# EAGLE design IRHat2 (EAGLE 9.5.2)
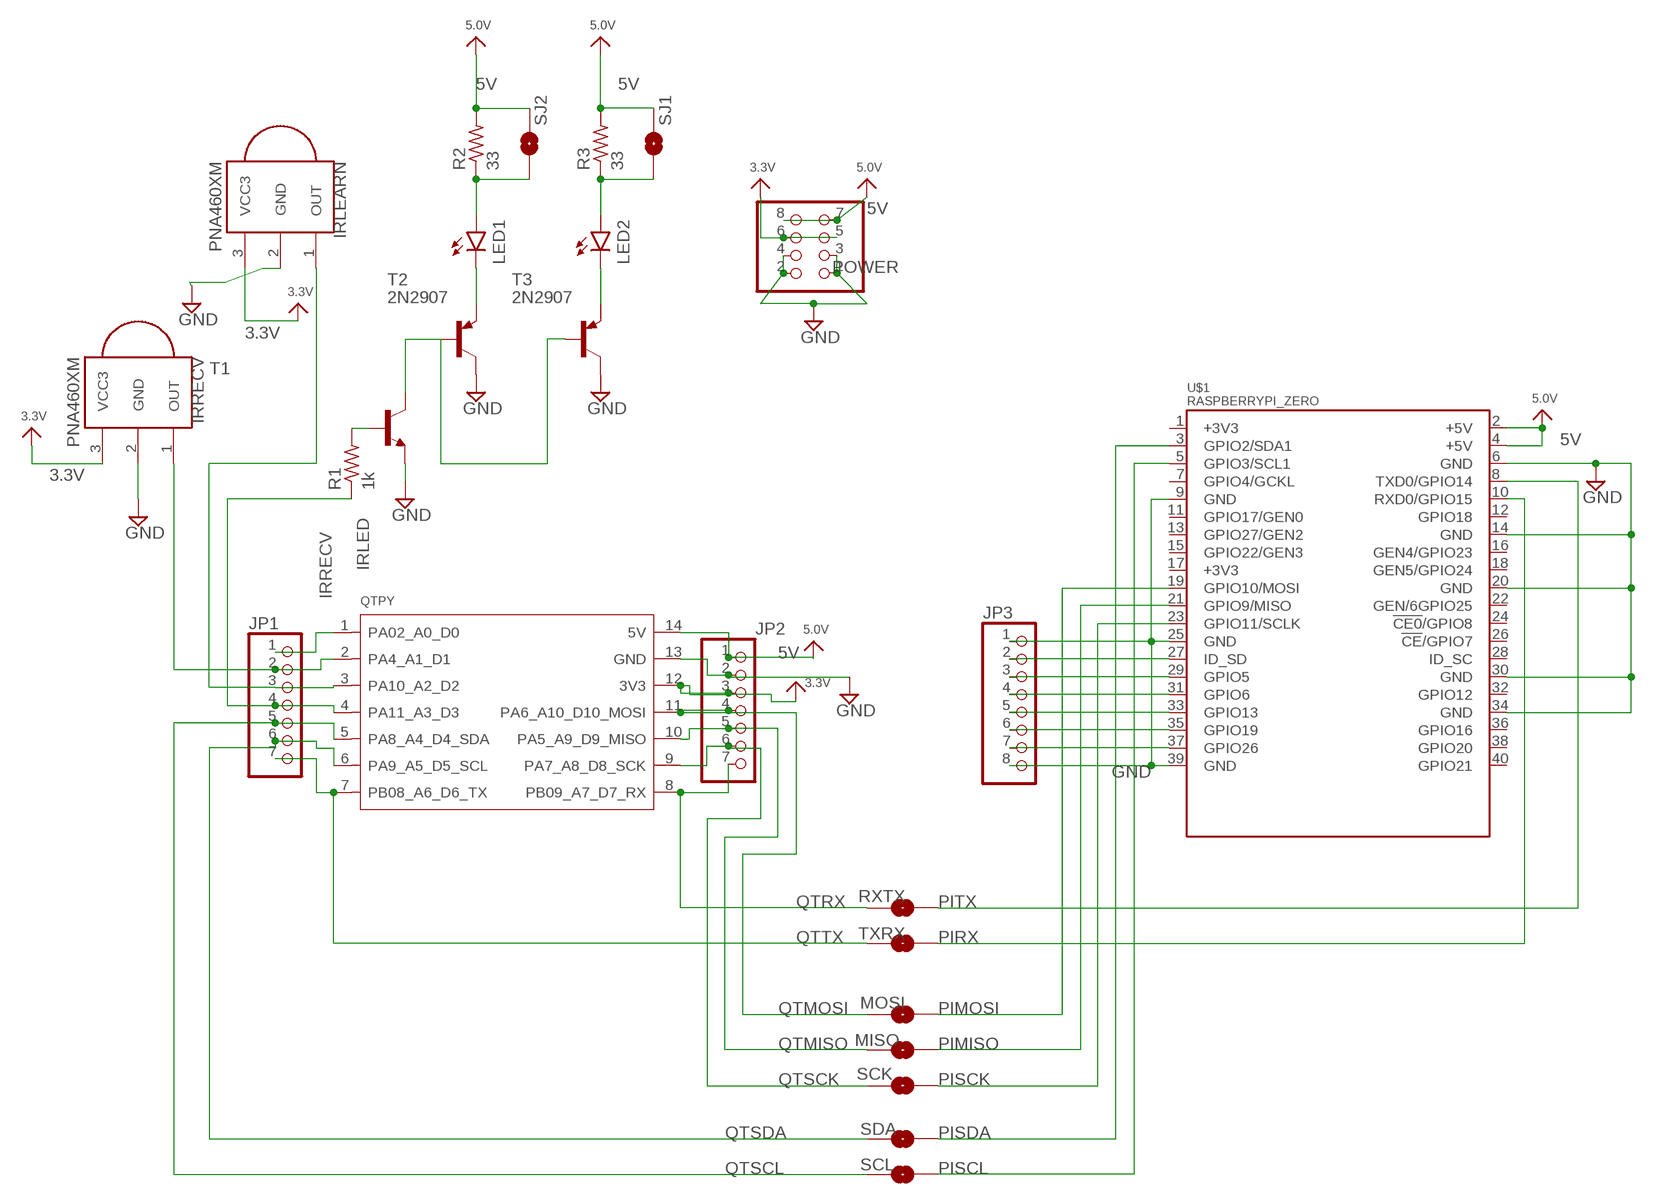
[diagram p0: schematic, sheet 1]

## Parts
IRLEARN  PNA460XM  [PNA460XM]
IRRECV  PNA460XM  [PNA460XM]
JP1  PINHD-1X7  [1X07]
JP2  PINHD-1X7  [1X07]
JP3  PINHD-1X8CLEANBIG  [1X08-CLEANBIG]
LED1  LED-IRTSAL6100  [LED_5MM]
LED2  LED-IRTSAL6100  [LED_5MM]
MISO  SPARKFUN_SOLDERJUMPERNO  [SPARKFUN_SJ_2S-NO]
MOSI  SPARKFUN_SOLDERJUMPERNO  [SPARKFUN_SJ_2S-NO]
POWER  PINHD-2X4  [2X04]
QTPY  MOUDLE-SEEEDUINO-XIAO  [MOUDLE14P-2.54-21X17.8MM]
R1  1k  R-US_0204/5  [0204/5]
R2  33  R-US_0204/5  [0204/5]
R3  33  R-US_0204/5  [0204/5]
RXTX  SPARKFUN_SOLDERJUMPERTRACE  [SPARKFUN_SJ_2S-TRACE]
SCK  SPARKFUN_SOLDERJUMPERNO  [SPARKFUN_SJ_2S-NO]
SCL  SPARKFUN_SOLDERJUMPERNO  [SPARKFUN_SJ_2S-NO]
SDA  SPARKFUN_SOLDERJUMPERNO  [SPARKFUN_SJ_2S-NO]
SJ1  SPARKFUN_SOLDERJUMPERTRACE  [SPARKFUN_SJ_2S-TRACE]
SJ2  SPARKFUN_SOLDERJUMPERTRACE  [SPARKFUN_SJ_2S-TRACE]
T1  -NPN-TO92-EBC  [TO92-EBC]
T2  2N2907  MPSA56-TO92  [TO92-CBE]
T3  2N2907  MPSA56-TO92  [TO92-CBE]
TXRX  SPARKFUN_SOLDERJUMPERTRACE  [SPARKFUN_SJ_2S-TRACE]
U$1  RASPBERRYPI_ZERO  [RASPBERRYPI_ZERO]

## Nets
3.3V: IRLEARN.3(VCC3) IRRECV.3(VCC3) JP2.3 POWER.5 POWER.6 QTPY.12(3V3)
5V: JP2.1 POWER.7 POWER.8 QTPY.14(5V) R2.2 R3.2 SJ1.2 SJ2.2 U$1.2(+5V) U$1.4(+5V) ; supply symbol labelled 5.0V
GND: IRLEARN.2(GND) IRRECV.2(GND) JP2.2 JP3.1 JP3.8 POWER.1 POWER.2 POWER.3 POWER.4 QTPY.13(GND) T1.E T2.C T3.C U$1.6(GND) U$1.9(GND) U$1.14(GND) U$1.20(GND) U$1.25(GND) U$1.30(GND) U$1.34(GND) U$1.39(GND)
IRLED: JP1.4 QTPY.4(PA11_A3_D3) R1.1
IRRECV: IRRECV.1(OUT) JP1.2 QTPY.2(PA4_A1_D1)
N$1: JP3.2 U$1.27(ID_SD)
N$2: JP3.3 U$1.29(GPIO5)
N$3: LED1.K(C) T2.E
N$4: R1.2 T1.B
N$5: LED2.K(C) T3.E
N$6: JP3.4 U$1.31(GPIO6)
N$7: LED2.A R3.1 SJ1.1
N$8: T1.C T2.B T3.B
N$9: JP1.1 QTPY.1(PA02_A0_D0)
N$10: LED1.A R2.1 SJ2.1
N$11: JP3.5 U$1.33(GPIO13)
N$12: IRLEARN.1(OUT) JP1.3 QTPY.3(PA10_A2_D2)
N$13: JP3.6 U$1.35(GPIO19)
N$14: JP3.7 U$1.37(GPIO26)
PIMISO: MISO.2 U$1.21(GPIO9/MISO)
PIMOSI: MOSI.2 U$1.19(GPIO10/MOSI)
PIRX: TXRX.2 U$1.10(RXD0/GPIO15)
PISCK: SCK.2 U$1.23(GPIO11/SCLK)
PISCL: SCL.2 U$1.5(GPIO3/SCL1)
PISDA: SDA.2 U$1.3(GPIO2/SDA1)
PITX: RXTX.2 U$1.8(TXD0/GPIO14)
QTMISO: JP2.5 MISO.1 QTPY.10(PA5_A9_D9_MISO)
QTMOSI: JP2.4 MOSI.1 QTPY.11(PA6_A10_D10_MOSI)
QTRX: JP2.7 QTPY.8(PB09_A7_D7_RX) RXTX.1
QTSCK: JP2.6 QTPY.9(PA7_A8_D8_SCK) SCK.1
QTSCL: JP1.5 QTPY.5(PA8_A4_D4_SDA) SCL.1
QTSDA: JP1.6 QTPY.6(PA9_A5_D5_SCL) SDA.1
QTTX: JP1.7 QTPY.7(PB08_A6_D6_TX) TXRX.1
Unconnected: U$1.1(+3V3) U$1.7(GPIO4/GCKL) U$1.11(GPIO17/GEN0) U$1.12(GPIO18) U$1.13(GPIO27/GEN2) U$1.15(GPIO22/GEN3) U$1.16(GEN4/GPIO23) U$1.17(+3V3) U$1.18(GEN5/GPIO24) U$1.22(GEN/6GPIO25) U$1.24(!CE0!/GPIO8) U$1.26(!CE!/GPIO7) U$1.28(ID_SC) U$1.32(GPIO12) U$1.36(GPIO16) U$1.38(GPIO20) U$1.40(GPIO21)

## Library data of the parts
IRLEARN IRRECV = adafruit:PNA460XM: IR 38KHz receiver PNA4602 and related receivers http://www.ladyada.net/library/pcb/eaglelibrary.html
JP1 JP2 = pinhead:PINHD-1X7: PIN HEADER
JP3 = adafruit:PINHD-1X8: PIN HEADER
LED1 LED2 = SparkFun-LED:LED-IR: Infrared LED (IR) Wavelength: 940nm Packages: TSAL6100 LTE302 - Side firing. Check SparkFun-Sensors.lbr for the receiver SparkFun Products: ZX Distance and Gesture Sensor <[https://www.sparkfun.com/products/12780]> Infrared Emitters and Detectors <https://www.sparkfun.com/products/241>; PROD_ID: DIO-12058
MISO MOSI RXTX SCK SCL SDA SJ1 SJ2 TXRX = DECADE:SPARKFUN_SOLDERJUMPER: Solder Jumper Standard SMD solder jumper. Used to automate production. Two varients : Normally Open and Normally Closed are the same, but have different paste layers. NC will have a large amount of paste and should jumper during reflow.
POWER = adafruit:PINHD-2X4: PIN HEADER
QTPY = Seeeduino XIAO:MOUDLE-SEEEDUINO-XIAO
R1 = resistor:R-US_: RESISTOR, American symbol
R2 R3 = adafruit:R-US_: RESISTOR, American symbol
T1 = transistor:*-NPN-: NPN Transistror BF959 corrected 2008.03.06
T2 T3 = transistor-pnp:*-?: PNP Transistor
U$1 = milador:RASPBERRYPI_ZERO

## Board
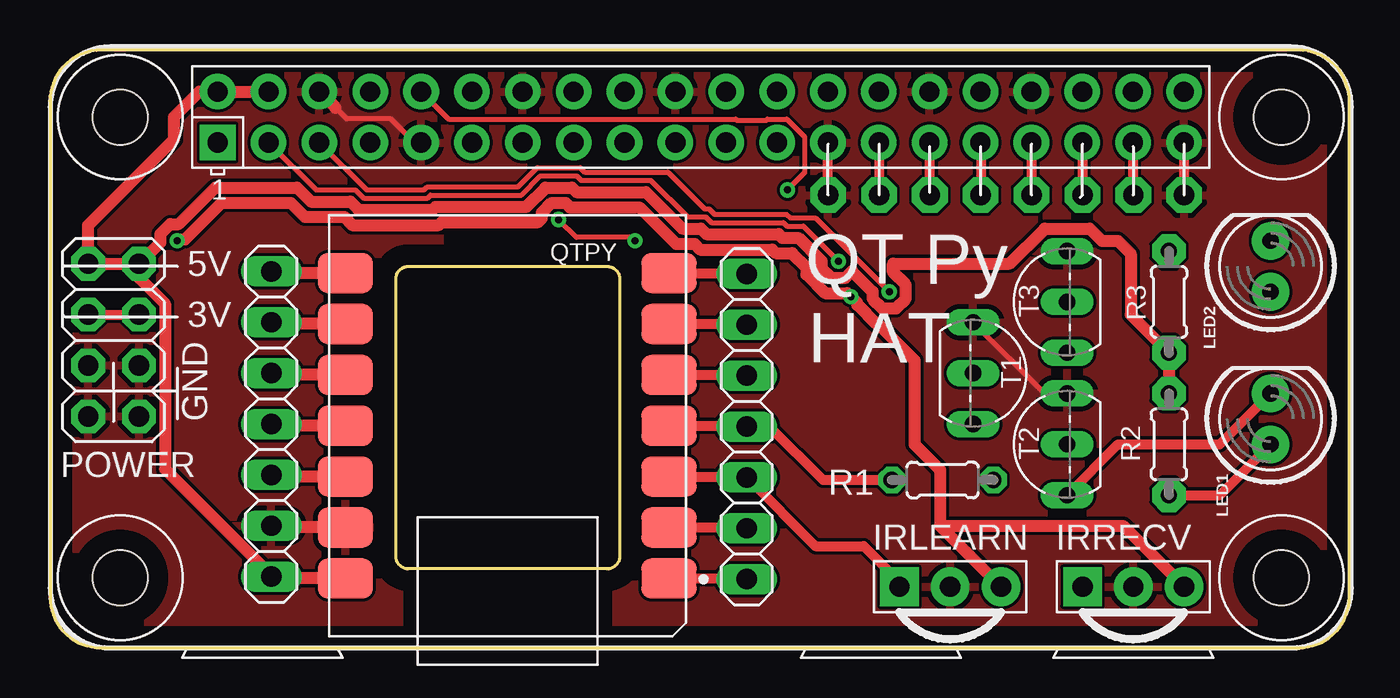
[diagram p1: board, top side]
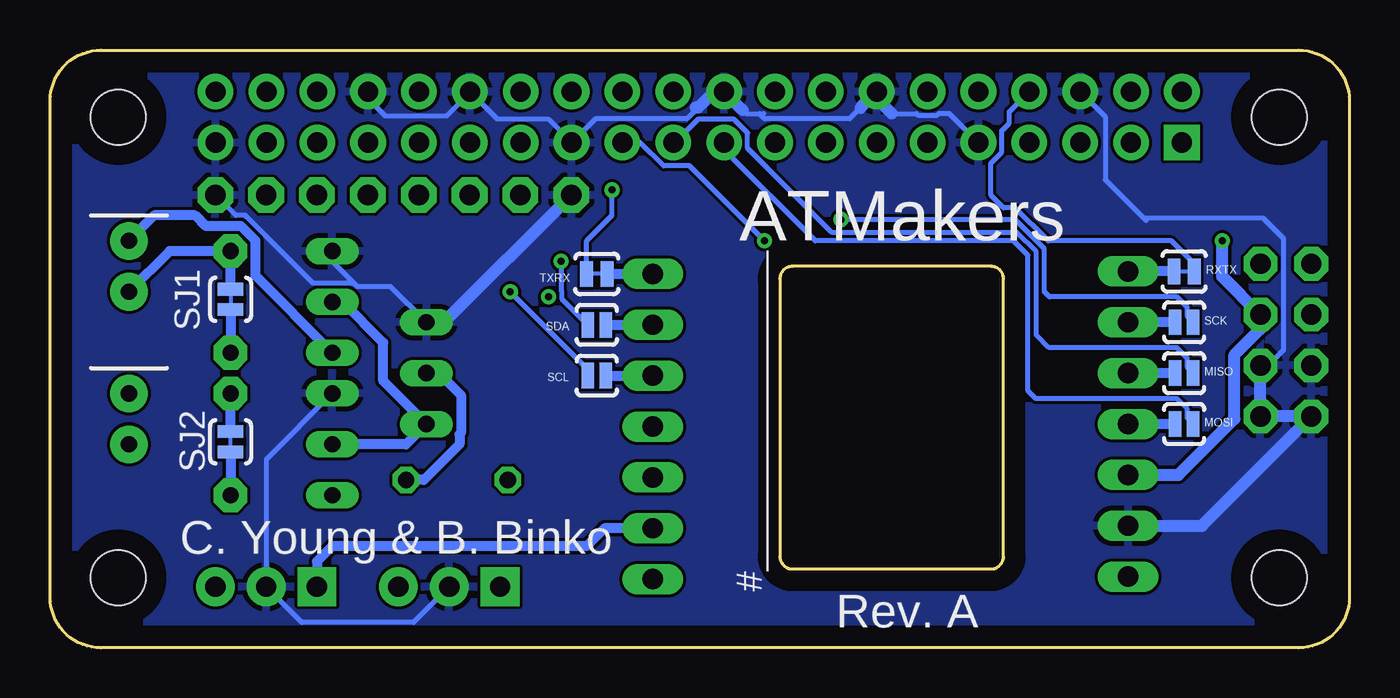
[diagram p2: board, bottom side, seen from below]

Size 64.9 x 29.84 mm. Coordinates in mm from the lower left corner, seen from the top.
Outline: 0,27.3 0,2.54 arc90 2.54,0 62.36,0 arc90 64.9,2.54 64.9,27.3 arc90 62.36,29.84 2.54,29.84 arc90 0,27.3
Outline: 27.81,3.94 17.91,3.94 arc-90 17.27,4.57 17.27,18.41 arc-90 17.91,19.05 27.81,19.05 arc-90 28.45,18.41 28.45,4.57 arc-90 27.81,3.94
Copper layers (1*16): Top 0.035mm / dielectric 1.5mm / Bottom 0.035mm
Design rules "default *": minimum track width 6mil, minimum drill 0.35mm, track to track 6mil, track to pad 6mil, pad to pad 6mil, via to via 6mil, smd to smd 6mil, copper to edge 40mil, drill to drill 6mil, minimum pad ring 10mil, minimum via ring 8mil, stop-mask expansion 4mil, vias tented up to drill 25mil, thermal gap 10mil

### Footprints (pad centres in the part's own frame; a part is rotated, then mirrored left to right if it is on the bottom)
PNA460XM = drill 1.016 pad 1.93 square: 1 -2.54,0 | drill 1.016 pad 1.93: 2 0,0; 3 2.54,0
1X07 = drill 1.016 long: 1 -7.62,0; 2 -5.08,0; 3 -2.54,0; 4 0,0; 5 2.54,0; 6 5.08,0; 7 7.62,0
1X08-CLEANBIG = drill 1.016 pad 1.778 octagon: 1 -8.89,0; 2 -6.35,0; 3 -3.81,0; 4 -1.27,0; 5 1.27,0; 6 3.81,0; 7 6.35,0; 8 8.89,0
LED_5MM = drill 0.813 pad 1.88: A -1.27,0; K 1.27,0
SPARKFUN_SJ_2S-NO = smd 0.635 x 1.27: 1 -0.45,0; 2 0.45,0
2X04 = drill 1.016 pad 1.676 octagon: 1 -3.81,-1.27; 2 -3.81,1.27; 3 -1.27,-1.27; 4 -1.27,1.27; 5 1.27,-1.27; 6 1.27,1.27; 7 3.81,-1.27; 8 3.81,1.27
MOUDLE14P-2.54-21X17.8MM = smd 2.75 x 2: 1 0.835,18.12; 2 0.835,15.58; 3 0.835,13.04; 4 0.835,10.5; 5 0.835,7.96; 6 0.835,5.42; 7 0.835,2.88; 8 17,2.88; 9 17,5.42; 10 17,7.96; 11 17,10.5; 12 17,13.04; 13 17,15.58; 14 17,18.12
0204/5 = drill 0.813 octagon: 1 -2.54,0; 2 2.54,0
0204/5' = drill 0.813 pad 1.676 octagon: 1 -2.54,0; 2 2.54,0
SPARKFUN_SJ_2S-TRACE = smd 0.635 x 1.27: 1 -0.508,0; 2 0.508,0
TO92-EBC = drill 0.813 long: B 0,-1.27; C 2.54,-1.27; E -2.54,-1.27
TO92-CBE = drill 0.813 long: B 0,0; C 2.54,0; E -2.54,0
RASPBERRYPI_ZERO = drill 1 pad 1.778 square: 1 8.37,25.23 | drill 1 pad 1.778: 2 8.37,27.77; 3 10.91,25.23; 4 10.91,27.77; 5 13.45,25.23; 6 13.45,27.77; 7 15.99,25.23; 8 15.99,27.77; 9 18.53,25.23; 10 18.53,27.77; 11 21.07,25.23; 12 21.07,27.77; 13 23.61,25.23; 14 23.61,27.77; 15 26.15,25.23; 16 26.15,27.77; 17 28.69,25.23; 18 28.69,27.77; 19 31.23,25.23; 20 31.23,27.77; 21 33.77,25.23; 22 33.77,27.77; 23 36.31,25.23; 24 36.31,27.77; 25 38.85,25.23; 26 38.85,27.77; 27 41.39,25.23; 28 41.39,27.77; 29 43.93,25.23; 30 43.93,27.77; 31 46.47,25.23; 32 46.47,27.77; 33 49.01,25.23; 34 49.01,27.77; 35 51.55,25.23; 36 51.55,27.77; 37 54.09,25.23; 38 54.09,27.77; 39 56.63,25.23; 40 56.63,27.77 | hole 2.75: 3.5,3.5; 3.5,26.5; 61.5,3.5; 61.5,26.5

### Placement (x,y rotation side)
IRLEARN  44.96,3.05 0 top
IRRECV  54.1,3.05 0 top
JP1  34.8,11.05 90 top
JP2  11.05,11.18 90 top
JP3  47.75,22.61 0 top
LED1  60.96,11.43 90 top
LED2  60.96,19.05 90 top
MISO  8.26,13.72 0 bottom
MOSI  8.26,11.18 0 bottom
POWER  3.17,15.37 90 top
QTPY  31.75,21.59 180 top
R1  44.58,8.38 0 top
R2  33  [0204/5']  55.88,10.16 90 top
R3  33  [0204/5']  55.88,17.27 270 top
RXTX  8.26,18.8 0 bottom
SCK  8.26,16.26 0 bottom
SCL  37.59,13.59 180 bottom
SDA  37.59,16.13 180 bottom
SJ1  55.88,17.4 270 bottom
SJ2  55.88,10.29 90 bottom
T1  47.37,13.72 270 top
T2  50.8,10.16 90 top
T3  50.8,17.27 90 top
TXRX  37.59,18.67 180 bottom
U$1  0,0 0 top

### Tracks (layer width: path | path; a pad name or v marks a point on that pad's centre or on a via)
3.3V  (via drill 0.35)
  Top 0.508: POWER.6 POWER.5
  Top 0.61: QTPY.12 11.13,8.55 JP2.3 | IRLEARN.3 44.45,6.1 | 44.45,6.1 44.45,8.89 43.18,10.16 43.18,14.35 41.35,16.18 41.25,16.18 40.31,17.12 40.31,17.22 v40.01,17.53 39.82,17.71 38.71,17.71 37.77,18.64 37.77,19 37.06,19.71 36.24,19.71 36.06,19.89 32.47,19.89 32.19,20.17 31.27,20.17 29.44,22 25.97,22 25.75,22.22 25.05,22.22 24.57,21.73 24.57,21.45 24.37,21.26 19.56,21.26 19.41,21.11 15.09,21.11 14.69,21.51 12.72,21.51 12.02,22.22 8.56,22.22 6.74,20.39 6.42,20.39 v6.35,20.32 | 44.45,6.1 53.59,6.1 IRRECV.3
  Bottom 0.61: JP2.3 8.53,8.64 5.74,11.43 5.74,14.63 4.45,15.93 POWER.5 6.35,18.54 v6.35,20.32
5V
  Top 0.61: QTPY.14 11.13,3.47 | 11.13,3.47 JP2.1 | POWER.7 POWER.8 1.91,21.09 6.2,25.38 6.2,26.52 7.45,27.77 U$1.2 U$1.4 | POWER.7 4.45,18.47 5.74,17.17 5.74,8.92 11.13,3.52 11.13,3.47 | POWER.7 5.51,20.25 5.51,20.67 6,21.16 6.42,21.16 8.25,22.98 12.33,22.98 13.04,22.28 15,22.28 15.41,21.87 19.09,21.87 19.24,22.02 23.78,22.02 24.74,22.98 26.06,22.98 26.29,22.76 29.75,22.76 31.59,20.93 32.5,20.93 32.78,20.65 36.38,20.65 36.56,20.47 37.38,20.47 38.53,19.31 38.53,18.96 39.02,18.47 39.72,18.47 40.06,18.81 41.08,17.79 41.08,17.43 41.56,16.95 42.26,16.95 42.74,17.43 42.74,18.13 42.11,18.76 42.11,19.18 47.92,19.18 49.68,20.93 51.92,20.93 52.53,20.32 53.34,20.32 53.98,19.68 53.98,16.64 R3.2 R2.2
  Bottom 0.508: SJ2.2 R2.2 | SJ1.2 R3.2
GND
  Top 0.254: U$1.9 18.2,25.23 17.02,26.42 14.8,26.42 14.26,26.96 | T1.E 49.66,12.7 T2.C
  Top 0.508: JP3.1 38.86,25.22 U$1.25 | U$1.39 JP3.8
  Top 0.61: QTPY.13 11.13,6.01 JP2.2 | 14.26,26.96 U$1.6
  Bottom 0.254: 30.3,26.84 30.13,26.67 29.46,26.67 | 29.46,26.67 29.24,26.67 | U$1.34 49.01,27.42 48.13,26.54 45.09,26.54 43.93,27.7 U$1.30 42.58,26.42 40.04,26.42 U$1.25 37.66,26.42 33.09,26.42 32.7,26.8 | 22.86,26.67 21.62,26.67 21.55,26.6 20.59,26.6 20.52,26.67 19.97,26.67 U$1.9 | U$1.6 12.19,26.51 12.19,23.37 10.29,21.46 | 10.29,21.46 10.16,21.34 | 10.29,21.46 4.32,21.46 3.3,20.45 3.3,14.86 4.06,14.1 POWER.3 | 24.42,26.96 24.96,26.42 29.21,26.42 29.46,26.67 | T1.E 47.88,18.03 49.53,18.03 | JP3.8 55.63,21.59 55.14,21.59 51.77,18.21 49.75,18.21 49.57,18.03 49.53,18.03 | T3.C 50.8,19.3 49.53,18.03 | T2.C 54.1,9.4 IRRECV.2 52.32,1.27 46.74,1.27 IRLEARN.2
  Bottom 0.61: POWER.3 POWER.1 POWER.2 7.37,6.1 JP2.2 | JP3.1 45.21,16.26 T1.E | 30.3,26.84 U$1.20 31.73,27.77 32.52,26.98 32.65,26.98 | 22.86,26.67 23.61,27.42 U$1.14 24.42,26.96
  pour Bottom: 0,30.48 64.77,30.48 64.77,0 0,0
  pour Top: 0,30.48 64.77,30.48 64.77,0 0,0
IRLED
  Top 0.508: QTPY.4 34.76,11.09 JP1.4 35.94,11.05 38.61,8.38 R1.1
IRRECV
  Top 0.508: QTPY.2 34.76,6.01 JP1.2
  Bottom 0.508: JP1.2 37.21,5.97 38.1,5.08 50.8,5.08 51.56,4.32 IRRECV.1
N$1
  Top 0.508: U$1.27 JP3.2
N$2
  Top 0.508: JP3.3 43.94,25.22 U$1.29
N$3
  Top 0.508: T2.E 53.34,10.16 58.42,10.16 LED1.K
N$4
  Bottom 0.508: T1.B 45.47,13.72 44.37,12.62 44.37,10.73 44.45,10.66 44.45,10.16 46.23,8.38 R1.2
N$5
  Bottom 0.508: T3.E 54.63,18.57 54.63,20.33 55.36,21.06 57.12,21.06 57.66,21.59 59.69,21.59 LED2.K
N$6
  Top 0.508: U$1.31 46.48,25.22 JP3.4
N$7
  Bottom 0.508: SJ1.1 R3.1 58.93,19.81 LED2.A
N$8
  Bottom 0.508: T2.B 47.12,10.16 T1.C 48.26,13.34 48.26,15.24 50.29,17.27 T3.B
N$9
  Top 0.508: QTPY.1 34.76,3.47 JP1.1
N$10
  Top 0.508: R2.1 58.42,7.62 LED1.A
  Bottom 0.508: SJ2.1 R2.1
N$11
  Top 0.508: U$1.33 49.02,25.22 JP3.5
N$12
  Top 0.508: QTPY.3 34.76,8.55 JP1.3 38.23,5.08 40.64,5.08 42.42,3.3 IRLEARN.1
N$13
  Top 0.508: U$1.35 JP3.6
N$14
  Top 0.508: U$1.37 JP3.7
PIMISO
  Bottom 0.254: MISO.2 8.11,14.02 8.11,14.47 8.63,14.99 15.01,14.99 15.65,15.62 15.65,19.77 16.61,20.73 25.84,20.73 30.06,24.95 30.06,25.71 30.75,26.4 32.53,26.4 33.7,25.23 U$1.21
PIMOSI
  Bottom 0.254: MOSI.2 8.11,11.48 8.11,11.93 8.63,12.45 15.67,12.45 16.05,12.83 16.05,19.6 16.77,20.32 26.67,20.32 31.23,24.88 U$1.19
PIRX  (via drill 0.35)
  Top 0.254: U$1.10 19.9,26.4 34.25,26.4 34.31,26.34 35.77,26.34 35.83,26.4 36.79,26.4 37.68,25.51 37.68,23.71 v36.83,22.86
  Bottom 0.254: v36.83,22.86 36.83,21.59 38.1,20.32 TXRX.2
PISCK  (via drill 0.35)
  Top 0.254: v29.21,20.32 29.04,20.5 26.29,20.5 v25.4,21.38
  Bottom 0.254: SCK.2 8.11,16.56 8.11,17.01 8.63,17.53 14.99,17.53 15.24,17.78 15.24,19.94 16.69,21.38 v25.4,21.38 | v29.21,20.32 32.95,24.06 34.25,24.06 35.42,25.23 U$1.23
PISCL  (via drill 0.35)
  Top 0.254: U$1.5 15.82,22.86 18.68,22.86 18.83,23.01 23.37,23.01 24.33,23.97 26.47,23.97 26.7,23.75 30.86,23.75 32.69,21.92 32.91,21.92 33.19,21.64 36.79,21.64 36.97,21.46 38.23,21.46 v41.91,17.78
  Bottom 0.254: v41.91,17.78 38.04,13.91 SCL.2
PISDA  (via drill 0.35)
  Top 0.254: U$1.3 13.28,22.86 15.24,22.86 15.65,22.45 18.85,22.45 19,22.61 23.54,22.61 24.5,23.57 26.3,23.57 26.53,23.34 30,23.34 31.83,21.51 32.74,21.51 33.02,21.23 36.62,21.23 36.8,21.06 37.62,21.06 v39.37,19.3
  Bottom 0.254: v39.37,19.3 39.37,17.82 39.35,17.8 39.35,17.43 SDA.2
PITX
  Bottom 0.254: RXTX.2 7.75,19.18 8.89,20.32 15.05,20.32 16.7,21.97 17.27,21.97 17.91,22.61 17.91,24.2 17.36,24.75 17.36,25.82 16.99,26.19 16.99,26.77 U$1.8
QTMISO
  Top 0.61: QTPY.10 11.13,13.63 JP2.5
  Bottom 0.508: MISO.1 JP2.5
QTMOSI
  Top 0.61: QTPY.11 11.77,11.09 11.43,11.43 11.3,11.43 JP2.4
  Bottom 0.508: MOSI.1 JP2.4
QTRX
  Top 0.61: QTPY.8 11.13,18.71 JP2.7
  Bottom 0.508: RXTX.1 JP2.7
QTSCK
  Top 0.61: QTPY.9 11.13,16.17 JP2.6
  Bottom 0.508: SCK.1 JP2.6
QTSCL
  Top 0.508: QTPY.5 34.76,13.63 JP1.5
  Bottom 0.508: SCL.1 JP1.5
QTSDA
  Top 0.508: QTPY.6 34.76,16.17 JP1.6
  Bottom 0.508: SDA.1 JP1.6
QTTX
  Top 0.508: QTPY.7 34.76,18.71 JP1.7
  Bottom 0.508: TXRX.1 JP1.7

### Text on the board
tPlace: 5V | QT Py | 3V | HAT | GND
bPlace: ATMakers | C. Young & B. Binko | #________________ | Rev. A